# Altium schematic sheet Afficheur_7_segments.SchDoc
size A4; SheetNumber: 2; SheetTotal: 3
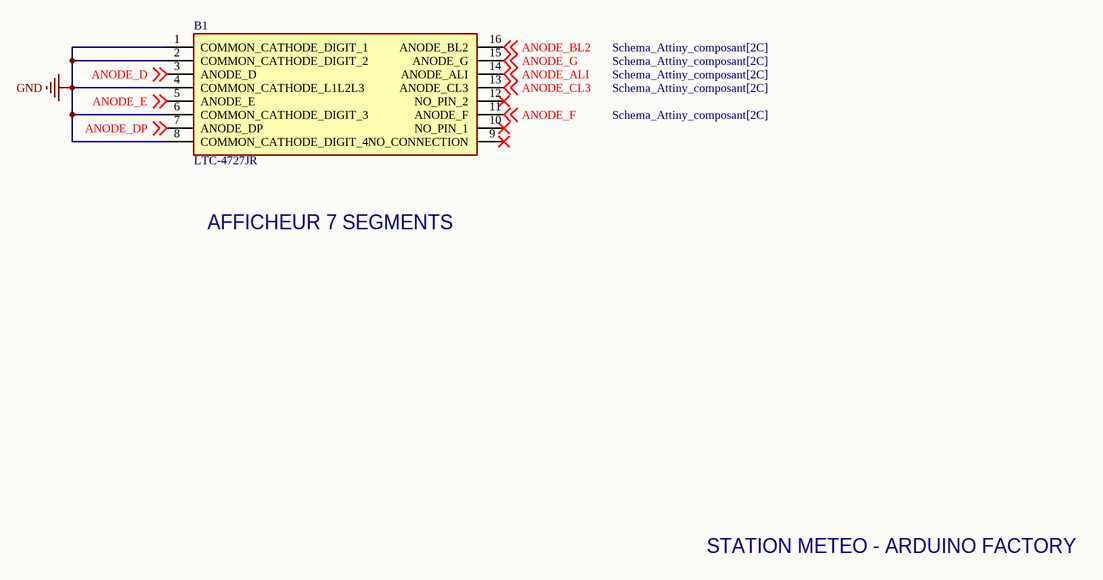
[diagram p0: Afficheur_7_segments.SchDoc]

## Parts
B1  LTC-4727JR  [DIP1016W75P254L4018H725Q16N]

## Nets
GND: B1.1(COMMON_CATHODE_DIGIT_1) B1.2(COMMON_CATHODE_DIGIT_2) B1.4(COMMON_CATHODE_L1L2L3) B1.6(COMMON_CATHODE_DIGIT_3) B1.8(COMMON_CATHODE_DIGIT_4)
ANODE_ALI: B1.14(ANODE_ALI) ; off-sheet ANODE_ALI
ANODE_BL2: B1.16(ANODE_BL2) ; off-sheet ANODE_BL2
ANODE_CL3: B1.13(ANODE_CL3) ; off-sheet ANODE_CL3
ANODE_D: B1.3(ANODE_D) ; off-sheet ANODE_D
ANODE_DP: B1.7(ANODE_DP) ; off-sheet ANODE_DP
ANODE_E: B1.5(ANODE_E) ; off-sheet ANODE_E
ANODE_F: B1.11(ANODE_F) ; off-sheet ANODE_F
ANODE_G: B1.15(ANODE_G) ; off-sheet ANODE_G

Not connected (* = marked no-connect by the designer): B1 9(NO_CONNECTION)* 10(NO_PIN_1)* 12(NO_PIN_2)*

## Notes on the sheet
- AFFICHEUR 7 SEGMENTS
- STATION METEO - ARDUINO FACTORY

## Library data of the parts
B1 = LTC-4727JR: Displays Panel 4DIGIT 35LED Sup. Red CC 14-Pin DIP Module; Manufacturer_Name: Lite-On; Geometry.Height: 7.25mm; Manufacturer_Part_Number: LTC-4727JR; Mouser Part Number: 859-LTC-4727JR; Mouser Price/Stock: https://www.mouser.co.uk/ProductDetail/Lite-On/LTC-4727JR?qs=WxFF5lh7QM1aHvF1YvDORQ%3D%3D; Arrow Part Number: LTC-4727JR; Arrow Price/Stock: https://www.arrow.com/en/products/ltc-4727jr/lite-on-technology?region=nac; Datasheet Link: https://componentsearchengine.com/Datasheets/1/LTC-4727JR.pdf